# EAGLE schematic TX v0 (EAGLE 7.4.0)
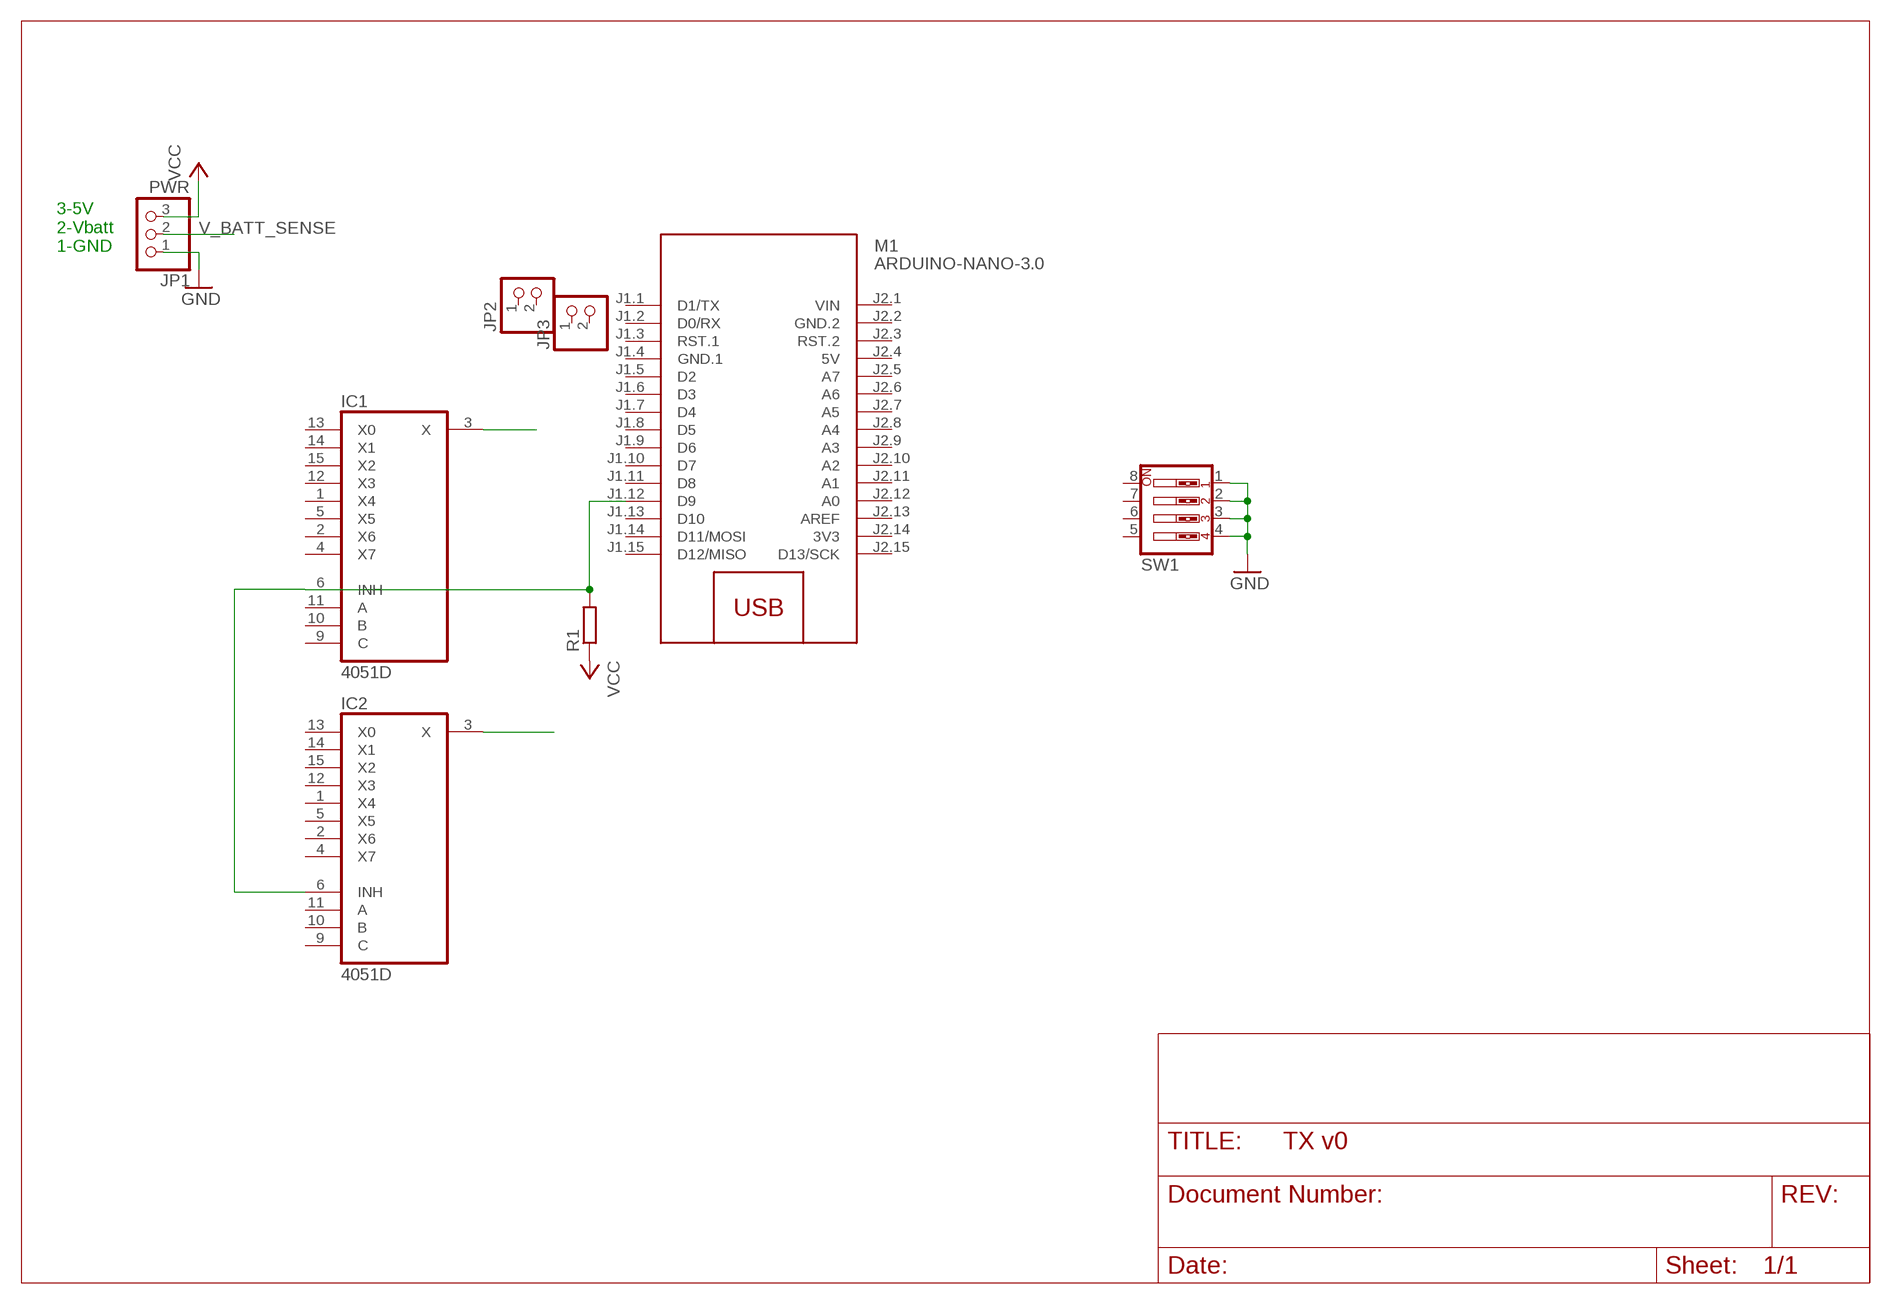
[diagram p0: schematic, sheet 1]

## Parts
IC1  4051D  [SO16]
IC2  4051D  [SO16]
JP1  PWR  PINHD-1X3  [1X03]
JP2  PINHD-1X2  [1X02]
JP3  PINHD-1X2  [1X02]
M1  ARDUINO-NANO-3.0  [ARDUINO-NANO-3.0]
R1  R-EU_0411/15  [0411/15]
SW1  SW_DIP-4  [EDG-04]

## Nets
GND: JP1.1 SW1.1 SW1.2 SW1.3 SW1.4
N$1: IC1.3(X)
N$2: IC1.6(INH) IC2.6(INH) M1.J1.12(D9) R1.2
N$3: IC2.3(X)
V_BATT_SENSE: JP1.2
VCC: JP1.3 R1.1
Unconnected: IC1.1(X4) IC1.2(X6) IC1.4(X7) IC1.5(X5) IC1.9(C) IC1.10(B) IC1.11(A) IC1.12(X3) IC1.13(X0) IC1.14(X1) IC1.15(X2) IC2.1(X4) IC2.2(X6) IC2.4(X7) IC2.5(X5) IC2.9(C) IC2.10(B) IC2.11(A) IC2.12(X3) IC2.13(X0) IC2.14(X1) IC2.15(X2) JP2.1 JP2.2 JP3.1 JP3.2 M1.J1.1(D1/TX) M1.J1.2(D0/RX) M1.J1.3(RST.1) M1.J1.5(D2) M1.J1.6(D3) M1.J1.7(D4) M1.J1.8(D5) M1.J1.9(D6) M1.J1.10(D7) M1.J1.11(D8) M1.J1.13(D10) M1.J1.14(D11/MOSI) M1.J1.15(D12/MISO) M1.J2.3(RST.2) M1.J2.5(A7) M1.J2.6(A6) M1.J2.7(A5) M1.J2.8(A4) M1.J2.9(A3) M1.J2.10(A2) M1.J2.11(A1) M1.J2.12(A0) M1.J2.13(AREF) M1.J2.15(D13/SCK) SW1.5 SW1.6 SW1.7 SW1.8

## Notes on the sheet
- 3-5V
  2-Vbatt
  1-GND

## Power pins joined to a net without a drawn wire
3V3: M1.J2.14(3V3)
5V: M1.J2.4(5V)
GND: IC1.8(GND) IC2.8(GND)
GND.1: M1.J1.4(GND.1)
GND.2: M1.J2.2(GND.2)
VCC: IC1.16(VCC) IC2.16(VCC)
VEE: IC1.7(VEE) IC2.7(VEE)
VIN: M1.J2.1(VIN)

## Library data of the parts
IC1 IC2 = 40xx:4051: 8-channel ANALOG MULTIPLEXER
JP1 = pinhead:PINHD-1X3: PIN HEADER
JP2 JP3 = pinhead:PINHD-1X2: PIN HEADER
M1 = diy-modules:ARDUINO-NANO-3.0: Arduino Nano 3.0 and compatible devices More details available here: https://www.arduino.cc/en/Main/ArduinoBoardNano Click here to find device on ebay.com <http://www.ebay.com/sch/arduino+nano>
R1 = rcl:R-EU_: RESISTOR, European symbol
SW1 = special:SW_DIP-4: DIP SWITCH